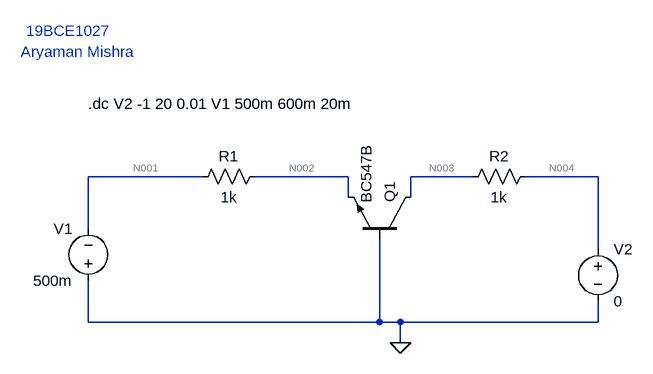
[diagram p0: schematic 6b-1.asc]
6b-1.asc, the LTspice schematic file:
Version 4
SHEET 1 888 680
WIRE 192 256 16 256
WIRE 416 256 272 256
WIRE 608 256 512 256
WIRE 800 256 688 256
WIRE 416 288 416 256
WIRE 512 288 512 256
WIRE 16 336 16 256
WIRE 800 368 800 256
WIRE 16 480 16 416
WIRE 464 480 464 352
WIRE 464 480 16 480
WIRE 496 480 464 480
WIRE 800 480 800 448
WIRE 800 480 496 480
WIRE 496 512 496 480
FLAG 496 512 0
SYMBOL npn 512 352 M270
SYMATTR InstName Q1
SYMATTR Value BC547B
SYMBOL voltage 16 432 R180
WINDOW 0 24 96 Left 2
WINDOW 3 24 16 Left 2
WINDOW 123 0 0 Left 0
WINDOW 39 0 0 Left 0
SYMATTR InstName V1
SYMATTR Value 500m
SYMBOL voltage 800 352 R0
WINDOW 123 0 0 Left 0
WINDOW 39 0 0 Left 0
SYMATTR InstName V2
SYMATTR Value 0
SYMBOL res 288 240 R90
WINDOW 0 0 56 VBottom 2
WINDOW 3 32 56 VTop 2
SYMATTR InstName R1
SYMATTR Value 1k
SYMBOL res 704 240 R90
WINDOW 0 0 56 VBottom 2
WINDOW 3 32 56 VTop 2
SYMATTR InstName R2
SYMATTR Value 1k
TEXT -80 32 Left 2 ;19BCE1027
TEXT -88 64 Left 2 ;Aryaman Mishra
TEXT 16 144 Left 2 !.dc V2 -1 20 0.01 V1 500m 600m 20m

The netlist it stands for:
* 6b-1.asc
Q1 N003 0 N002 0 BC547B
V1 0 N001 500m
V2 N004 0 0
R1 N002 N001 1k
R2 N004 N003 1k
.model NPN NPN
.model PNP PNP
.lib standard.bjt
* 19BCE1027
* Aryaman Mishra
.dc V2 -1 20 0.01 V1 500m 600m 20m
.backanno
.end

* Results of the author's LTspice run, read from the files saved beside the schematic
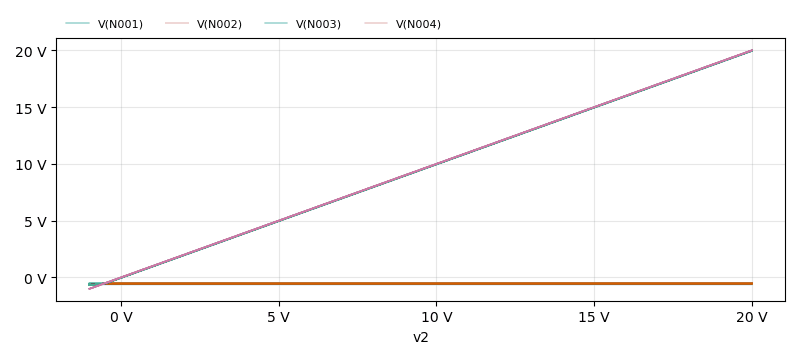
[diagram p1: DC transfer characteristic of 6b-1.asc, plotted from the saved traces]
* DC transfer characteristic, 6 runs:
*   V(N001) [v1=0.5]: -500 mV at v2=-1 V, -500 mV at v2=20 V, min -500 mV, max -500 mV
*   V(N001) [v1=0.52]: -520 mV at v2=-1 V, -520 mV at v2=20 V, min -520 mV, max -520 mV
*   V(N001) [v1=0.54]: -540 mV at v2=-1 V, -540 mV at v2=20 V, min -540 mV, max -540 mV
*   V(N001) [v1=0.56]: -560 mV at v2=-1 V, -560 mV at v2=20 V, min -560 mV, max -560 mV
*   V(N001) [v1=0.58]: -580 mV at v2=-1 V, -580 mV at v2=20 V, min -580 mV, max -580 mV
*   V(N001) [v1=0.6]: -600 mV at v2=-1 V, -600 mV at v2=20 V, min -600 mV, max -600 mV
*   V(N002) [v1=0.5]: -643.5 mV at v2=-1 V, -494.6 mV at v2=20 V, min -643.5 mV, max -494.6 mV
*   V(N002) [v1=0.52]: -646 mV at v2=-1 V, -510.2 mV at v2=20 V, min -646 mV, max -510.2 mV
*   V(N002) [v1=0.54]: -648.3 mV at v2=-1 V, -523.6 mV at v2=20 V, min -648.3 mV, max -523.6 mV
*   V(N002) [v1=0.56]: -650.5 mV at v2=-1 V, -534.8 mV at v2=20 V, min -650.5 mV, max -534.8 mV
*   V(N002) [v1=0.58]: -652.5 mV at v2=-1 V, -544.1 mV at v2=20 V, min -652.5 mV, max -544.1 mV
*   V(N002) [v1=0.6]: -654.4 mV at v2=-1 V, -551.8 mV at v2=20 V, min -654.4 mV, max -551.8 mV
*   V(N003) [v1=0.5]: -644.4 mV at v2=-1 V, 19.99 V at v2=20 V, min -644.4 mV, max 19.99 V
*   V(N003) [v1=0.52]: -646.3 mV at v2=-1 V, 19.99 V at v2=20 V, min -646.3 mV, max 19.99 V
*   V(N003) [v1=0.54]: -648.1 mV at v2=-1 V, 19.98 V at v2=20 V, min -648.1 mV, max 19.98 V
*   V(N003) [v1=0.56]: -649.8 mV at v2=-1 V, 19.97 V at v2=20 V, min -649.8 mV, max 19.97 V
*   V(N003) [v1=0.58]: -651.5 mV at v2=-1 V, 19.96 V at v2=20 V, min -651.5 mV, max 19.96 V
*   V(N003) [v1=0.6]: -653 mV at v2=-1 V, 19.95 V at v2=20 V, min -653 mV, max 19.95 V
*   V(N004) [v1=0.5]: -1 V at v2=-1 V, 20 V at v2=20 V, min -1 V, max 20 V
*   V(N004) [v1=0.52]: -1 V at v2=-1 V, 20 V at v2=20 V, min -1 V, max 20 V
*   V(N004) [v1=0.54]: -1 V at v2=-1 V, 20 V at v2=20 V, min -1 V, max 20 V
*   V(N004) [v1=0.56]: -1 V at v2=-1 V, 20 V at v2=20 V, min -1 V, max 20 V
*   V(N004) [v1=0.58]: -1 V at v2=-1 V, 20 V at v2=20 V, min -1 V, max 20 V
*   V(N004) [v1=0.6]: -1 V at v2=-1 V, 20 V at v2=20 V, min -1 V, max 20 V